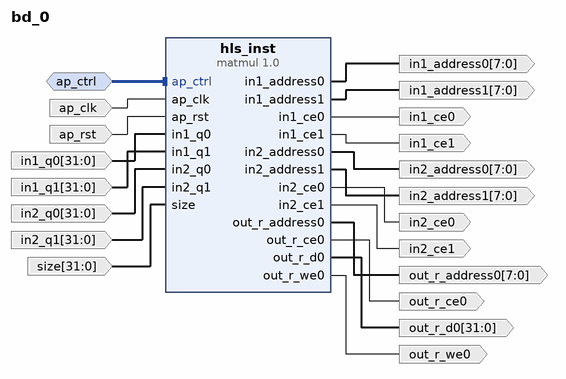
[diagram p0: block diagram of the top level]
# Vivado block design bd_0, xc7z010clg400-1, Vivado 2025.2
create_bd_design bd_0

create_bd_intf_port -mode Slave -vlnv xilinx.com:interface:acc_handshake_rtl:1.0 ap_ctrl
create_bd_port -dir I -type clk ap_clk
set_property -dict {CONFIG.FREQ_HZ 100000000.0} [get_bd_ports ap_clk]
create_bd_port -dir I -type rst ap_rst
set_property -dict {CONFIG.POLARITY ACTIVE_HIGH} [get_bd_ports ap_rst]
create_bd_port -dir O -from 7 -to 0 -type data in1_address0
create_bd_port -dir O -from 7 -to 0 -type data in1_address1
create_bd_port -dir O in1_ce0
create_bd_port -dir O in1_ce1
create_bd_port -dir I -from 31 -to 0 -type data in1_q0
create_bd_port -dir I -from 31 -to 0 -type data in1_q1
create_bd_port -dir O -from 7 -to 0 -type data in2_address0
create_bd_port -dir O -from 7 -to 0 -type data in2_address1
create_bd_port -dir O in2_ce0
create_bd_port -dir O in2_ce1
create_bd_port -dir I -from 31 -to 0 -type data in2_q0
create_bd_port -dir I -from 31 -to 0 -type data in2_q1
create_bd_port -dir O -from 7 -to 0 -type data out_r_address0
create_bd_port -dir O out_r_ce0
create_bd_port -dir O -from 31 -to 0 -type data out_r_d0
create_bd_port -dir O out_r_we0
create_bd_port -dir I -from 31 -to 0 -type data size

create_bd_cell -type ip -vlnv xilinx.com:hls:matmul:1.0 hls_inst

# ---- connections ----

connect_bd_intf_net -intf_net ap_ctrl_0_1 [get_bd_intf_ports ap_ctrl] [get_bd_intf_pins hls_inst/ap_ctrl]
connect_bd_net -net ap_clk_0_1 [get_bd_ports ap_clk] [get_bd_pins hls_inst/ap_clk]
connect_bd_net -net ap_rst_0_1 [get_bd_ports ap_rst] [get_bd_pins hls_inst/ap_rst]
connect_bd_net [get_bd_pins hls_inst/in1_address0] [get_bd_ports in1_address0]
connect_bd_net [get_bd_pins hls_inst/in1_address1] [get_bd_ports in1_address1]
connect_bd_net [get_bd_pins hls_inst/in1_ce0] [get_bd_ports in1_ce0]
connect_bd_net [get_bd_pins hls_inst/in1_ce1] [get_bd_ports in1_ce1]
connect_bd_net [get_bd_pins hls_inst/in2_address0] [get_bd_ports in2_address0]
connect_bd_net [get_bd_pins hls_inst/in2_address1] [get_bd_ports in2_address1]
connect_bd_net [get_bd_pins hls_inst/in2_ce0] [get_bd_ports in2_ce0]
connect_bd_net [get_bd_pins hls_inst/in2_ce1] [get_bd_ports in2_ce1]
connect_bd_net [get_bd_pins hls_inst/out_r_address0] [get_bd_ports out_r_address0]
connect_bd_net [get_bd_pins hls_inst/out_r_ce0] [get_bd_ports out_r_ce0]
connect_bd_net [get_bd_pins hls_inst/out_r_d0] [get_bd_ports out_r_d0]
connect_bd_net [get_bd_pins hls_inst/out_r_we0] [get_bd_ports out_r_we0]
connect_bd_net -net in1_q0_0_1 [get_bd_ports in1_q0] [get_bd_pins hls_inst/in1_q0]
connect_bd_net -net in1_q1_0_1 [get_bd_ports in1_q1] [get_bd_pins hls_inst/in1_q1]
connect_bd_net -net in2_q0_0_1 [get_bd_ports in2_q0] [get_bd_pins hls_inst/in2_q0]
connect_bd_net -net in2_q1_0_1 [get_bd_ports in2_q1] [get_bd_pins hls_inst/in2_q1]
connect_bd_net -net size_0_1 [get_bd_ports size] [get_bd_pins hls_inst/size]

validate_bd_design
save_bd_design
